# Altium schematic sheet drv8886_breakout.SchDoc
size A
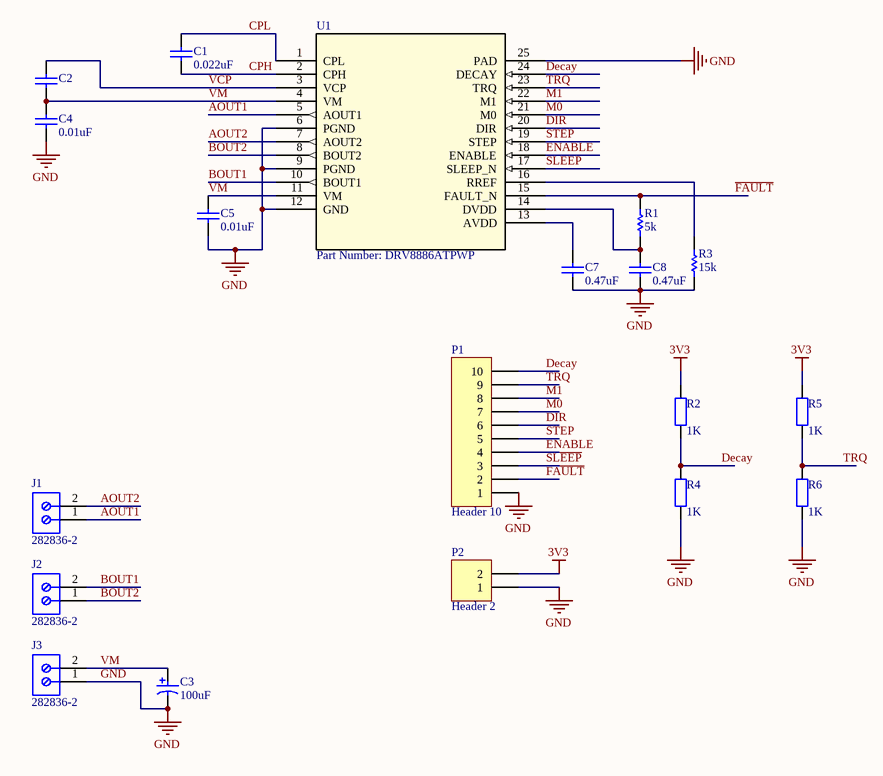
[diagram p0: drv8886_breakout.SchDoc]

## Parts
C1  0.022uF  [CAPC1608X87X35ML15T15]
C2  0.22uF  [TDK-C1608-2_A_M]  (value not drawn)
C3  100uF  [PNSC-FK-V-F_V]
C4  0.01uF  [CAPC1608X87X35LL15T15]
C5  0.01uF  [CAPC1608X87X35LL15T15]
C7  0.47uF  [CAPC1608X90X35ML15T15]
C8  0.47uF  [CAPC1608X90X35ML15T15]
J1  282836-2  [TECO-282836-2_V]
J2  282836-2  [TECO-282836-2_V]
J3  282836-2  [TECO-282836-2_V]
P1  Header 10  [HDR1X10]
P2  Header 2  [HDR1X2]
R1  5k  [RESC1608X55X25ML10T15]
R2  value 1K  [AXIAL-0.4]  (hidden comment: ?)
R3  15k  [RESC1608X55X25ML10T15]
R4  value 1K  [AXIAL-0.4]  (hidden comment: Res2)
R5  value 1K  [AXIAL-0.4]  (hidden comment: ?)
R6  value 1K  [AXIAL-0.4]  (hidden comment: Res2)
U1  Part Number: DRV8886ATPWP  [PWP0024B_N]

## Nets
3V3: P2.2 R2.2 R5.2
GND: C3.2 C4.2 C5.2 C7.1 C8.1 J3.1 P1.1 P2.1 R3.1 R4.1 R6.1 U1.6(PGND) U1.9(PGND) U1.12(GND) U1.25(PAD)
~{FAULT}: P1.2 R1.2 U1.15(FAULT_N)
~{SLEEP}: P1.3 U1.17(SLEEP_N)
AOUT1: J1.1 U1.5(AOUT1)
AOUT2: J1.2 U1.7(AOUT2)
BOUT1: J2.2 U1.10(BOUT1)
BOUT2: J2.1 U1.8(BOUT2)
CPH: C1.1 U1.2(CPH)
CPL: C1.2 U1.1(CPL)
Decay: P1.10 R2.1 R4.2 U1.24(DECAY)
DIR: P1.6 U1.20(DIR)
ENABLE: P1.4 U1.18(ENABLE)
M0: P1.7 U1.21(M0)
M1: P1.8 U1.22(M1)
STEP: P1.5 U1.19(STEP)
TRQ: P1.9 R5.1 R6.2 U1.23(TRQ)
VCP: C2.2 U1.3(VCP)
VM: C2.1 C3.1 C4.1 C5.1 J3.2 U1.4(VM) U1.11(VM)
NetC7_2: C7.2 U1.13(AVDD)
NetC8_2: C8.2 R1.1 U1.14(DVDD)
NetR3_2: R3.2 U1.16(RREF)

## Library data of the parts
C1 = CMP-2006-03139-1: Part Number: C0603C223K4RACTU; Manufacturer: Kemet
C2 = CMP-2000-05394-1: Cap Ceramic, 0.22 uF, +/- 10%, -55 to 125 degC, 2-Pin SMD (0603), RoHS, Tape and Reel; Manufacturer: TDK; PCN Part Number: MLCCPartNumberChange30/Nov/2012; Capacitance: 0.22µF; Other Names: 445-7408-1; Design Resources: 20WNon-IsolatedBuckLEDDriverUsingPLLNK460KG; Online Catalog: CSeries,GeneralPurpose; Kits: 445-9014-KIT-ND-KITMLCC100PF-22UF060310-50V445-9003-KIT-ND-KITCAPCERHICAPMLCCSMD445-173086-KIT-ND-C0402-2220X7R6.3-50V1,000PF-; Temperature Coefficient: X7R; Product Training Modules: CSeriesGeneralApplicationsSEAT,CCV,andTVCLDesignToolsGuidetoReplacinganElectrolyticCapacitorwithanMLCC; Voltage - Rated: 50V; Ratings: -; Lead Spacing: -; Package Description: 2-Pin Chip Capacitor, Body 1.7 x 0.9 mm; Datasheet URL: https://datasheet.ciiva.com/24218/c1608x7r1h224k080ab-264841-24218813.pdf; Applications: GeneralPurpose; Series: C; Manufacturer URL: http://www.tdk.com/; Size / Dimension: 0.063"Lx0.031"W(1.60mmx0.80mm); Features: -; Tolerance: ±10%; Package Reference: 603; Family: CeramicCapacitors; Standard Package: 1; RoHS Information: RoHSCertificate-MLCC; Thickness (Max): 0.035"(0.90mm); Package / Case: 0603(1608Metric); Operating Temperature: -55degC~125degC; Datasheet Version: Sep-13; Mounting Type: SurfaceMount,MLCC; Lead Style: -; Height - Seated (Max): -; Packaging: CutTape(CT); Category: Capacitors
C3 = CMP-2000-06208-1: Aluminum Electrolytic Capacitor, 100 uF, +/- 20%, 50 V, 2-Pin SMD (Size Code F), -55 to 105 degC, RoHS, Tape and Reel; Manufacturer: Panasonic; Impedance: 0.34O; Lifetime@Temperature: 2000Hrs@105°C; Ripple Current: 350mA; Type: Can; Rated Voltage: 50V; Capacitance: 100µF; Mounting Technology: SurfaceMount; Series: FK; Package URL: http://industrial.panasonic.com/cdbs/www-data/pdf/RDE0000/DME0000COL48.pdf; Datasheet URL: http://industrial.panasonic.com/cdbs/www-data/pdf/RDE0000/ABA0000C1181.pdf; Package Reference: FK-V-F; Operating Temp-Max: 105°C; Manufacturer URL: http://www.panasonic.com/; Operating Temp Range: -55to+105°C; Package Description: 2-Pin Electrolytic Aluminum Capacitor, Body 8.3 x 8.3 mm; Datasheet Version: 03/2016; Case Size/Dimension: Ø8x10.2mm
C4 C5 = CMP-2006-03299-1: Manufacturer: Kemet; Part Number: C0603X103K5RACTU
C7 C8 = CMP-2006-04187-1: Part Number: 06033C474KAT2A; Manufacturer: AVX Interconnect / Elco
J1-J3 = CMP-1684-00017-1: Female Header, Pitch 5 mm, 1 x 2 Position, Height 10 mm, Tail Length 3.5 mm, Rohs, Bulk; Manufacturer: TE Connectivity; Wire Gauge: 16-30AWG; Product Training Modules: Wire-to-BoardEurostyleTerminalBlocks; Clamp Material - Plating: Brass-NickelPlated; Voltage: 300V; Mating Orientation: HorizontalwithBoard; Current: 13.5A; Pitch: 0.197"(5.00mm); Screw Thread: M3; 3D Model: 282836-2.pdf; Other Names: 5ULV-02B / A98076; Dynamic Catalog: BuchananSeries; Number of Levels: 1; Torque - Screw: 0.68Nm(6Lb-In); Featured Product: EurostyleTerminalBlockConnectors; Positions Per Level: 2; Wire Termination: Screw-RisingCageClamp; Datasheet URL: http://www.te.com.cn/commerce/DocumentDelivery/DDEController?Action=showdoc&DocId=Catalog+Section%7F1308389_EUROSTYLE_TERMINAL_BLOCKS%7F0607%7Fpdf%7FEnglish%7FENG_CS_1308389_EUROSTYLE_TERMINAL_BLOCKS_0607.pdf%7F282836-2; Color: Green; Family: TerminalBlocks-WiretoBoard; RoHS Information: 282836-2StatementofCompliance; Standard Package: 300; Contact Material - Plating: Brass-TinPlated; Manufacturer URL: http://www.te.com; Housing Material: Polyamide(PA66),Nylon6/6; Features: Interlocking(Side); Package Description: Female Header, Pitch 5 mm, 1 x 2 Position, Height 10 mm, Tail Length 3.5 mm; Mounting Type: ThroughHole; Package Reference: THD; Packaging: Bulk; Series: Buchanan; Category: Connectors,Interconnects; Screw Material - Plating: Brass-NickelPlated
P1 = Header 10: Header, 10-Pin; LatestRevisionDate: 17-Jul-2002; LatestRevisionNote: Re-released for DXP Platform.; Publisher: Altium Limited
P2 = Header 2: Header, 2-Pin; LatestRevisionDate: 17-Jul-2002; LatestRevisionNote: Re-released for DXP Platform.; Publisher: Altium Limited
R1 R3 = CMP-2100-03667-1: Chip Resistor, 0 Ohm, +/- 5%, 0.1 W, -55 to 155 degC, 0603 (1608 Metric), RoHS, Tape and Reel; Manufacturer: Yageo; Temperature Coefficient: 200ppm/degreesC; Voltage Rating: 50V; Power Rating: 100mW; Resistance: 0mOhm; Width: 0.8mm; Max Operating Temperature: 155degC; Tolerance: 5%; Package Reference: 0603; Height: 0.45mm; Depth: 0.8mm; Package Description: 2-Pin Surface Mount Device, Body 1.6 x 0.8 mm; Termination: SMD/SMT; Package Quantity: 5000; Case/Package: 0603; Case Code (Imperial): 0603; Radiation Hardening: No; Number of Pins: 2; Length: 1.6mm; Lead Free: LeadFree; Voltage Rating (DC): 50V; Military Standard: Not; Datasheet URL: http://www.yageo.com/NewPortal/yageodocoutput?fileName=/pdf/R-Chip/PYu-RC_Group_51_RoHS_L_5.pdf; Manufacturer URL: http://www.yageo.com/; Packaging: TapeandReel; Case Code (Metric): 1608; Min Operating Temperature: -55degC; Composition: ThickFilm; RoHSCompliant: true; Contact Plating: Tin; Datasheet Version: Rev. 5, 10/2016; REACH SVHC: NoSVHC
R2 R4-R6 = Res2: Resistor; Published: 8-Jun-2000; LatestRevisionDate: 17-Jul-2002; LatestRevisionNote: Re-released for DXP Platform.; PackageReference: AXIAL-0.4; Publisher: Altium Limited; PackageDescription: Axial Device, Thru-Hole; 2 Leads; 0.4 in Pin Spacing
U1 = DRV8886ATPWP: No Description Available; Vendor: Texas Instruments; Built_By: EMA_Jessica; Manufacturer_Part_Number: DRV8886ATPWP; Copyright: Copyright (C) 2018 Accelerated Designs. All rights reserved; RefDes: RefDes; Type: DEV; Value: Value